# Altium schematic sheet fpga-bank1-outside.SchDoc: FPGA - Bank 1
size Letter; CheckedBy: E. Chiu; CompanyName: Brinton Engineering, LLC; DrawnBy: J. Brinton; Engineer: J. Brinton; Address1: 3479 Edison Way; Address2: Menlo Park CA 94025; Address3: +1 (877) 778-8435; Address4: brintonengineering.com; Revision: 1; SheetNumber: 9; SheetTotal: 48
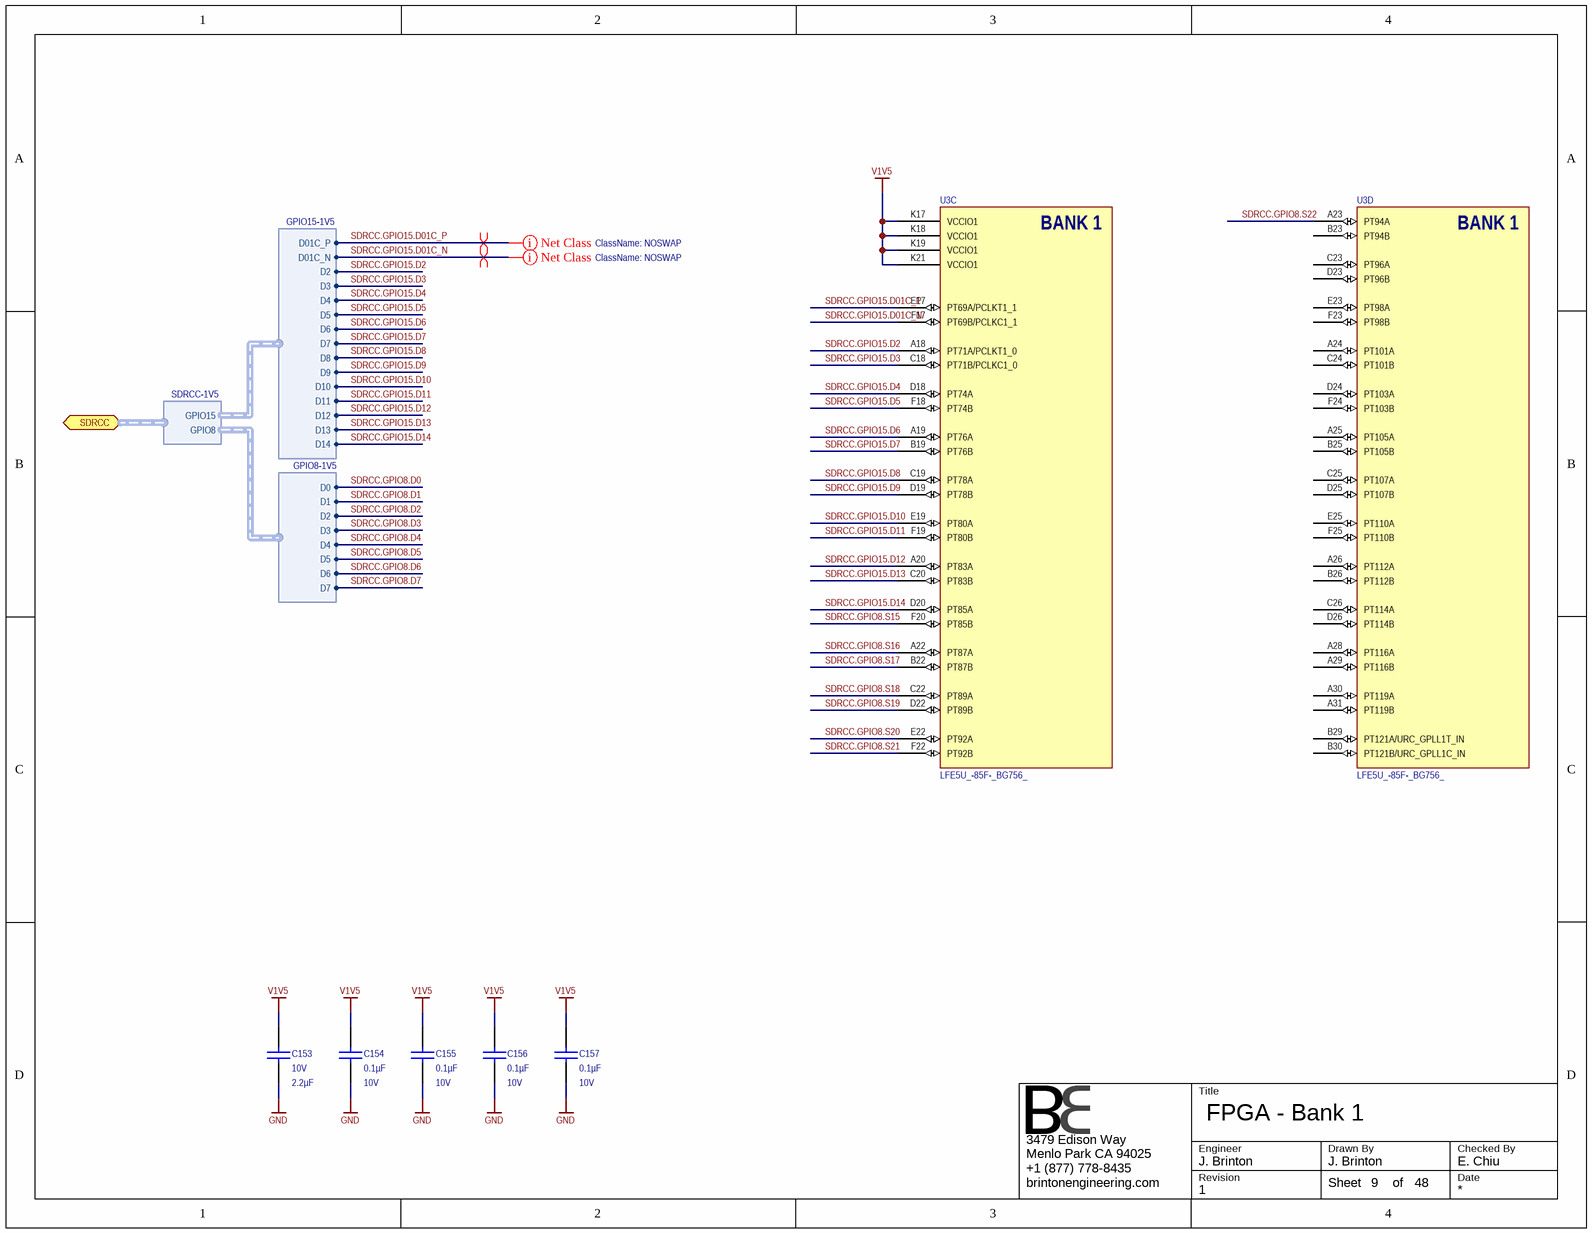
[diagram p0: fpga-bank1-outside.SchDoc]

## Parts
C153  Voltage - Rated: 10V  Capacitance: 2.2µF  [CAPC1608X90N]  (hidden comment: GRM188R71A225KE15D)
C154  Capacitance: 0.1µF  Voltage - Rated: 10V  [CAPC1005X56N]  (hidden comment: GRM155R71A104KA01J)
C155  Capacitance: 0.1µF  Voltage - Rated: 10V  [CAPC1005X56N]  (hidden comment: GRM155R71A104KA01J)
C156  Capacitance: 0.1µF  Voltage - Rated: 10V  [CAPC1005X56N]  (hidden comment: GRM155R71A104KA01J)
C157  Capacitance: 0.1µF  Voltage - Rated: 10V  [CAPC1005X56N]  (hidden comment: GRM155R71A104KA01J)
U3  LFE5U_-85F-_BG756_  [caBGA756]  (parts C,D of 19)

## Ports
SDRCC (harness SDRCC-1V5)

## Harnesses
GPIO8-1V5: D0, D1, D2, D3, D4, D5, D6, D7
GPIO15-1V5: D01C_P, D01C_N, D2, D3, D4, D5, D6, D7, D8, D9, D10, D11, D12, D13, D14
SDRCC-1V5: GPIO15, GPIO8

## Nets
GND: C153.1 C154.1 C155.1 C156.1 C157.1
V1V5: C153.2 C154.2 C155.2 C156.2 C157.2 U3.K17(VCCIO1) U3.K18(VCCIO1) U3.K19(VCCIO1) U3.K21(VCCIO1)
SDRCC.GPIO8.D0: harness GPIO8-1V5.D0
SDRCC.GPIO8.D1: harness GPIO8-1V5.D1
SDRCC.GPIO8.D2: harness GPIO8-1V5.D2
SDRCC.GPIO8.D3: harness GPIO8-1V5.D3
SDRCC.GPIO8.D4: harness GPIO8-1V5.D4
SDRCC.GPIO8.D5: harness GPIO8-1V5.D5
SDRCC.GPIO8.D6: harness GPIO8-1V5.D6
SDRCC.GPIO8.D7: harness GPIO8-1V5.D7
SDRCC.GPIO8.S15: U3.F20(PT85B)
SDRCC.GPIO8.S16: U3.A22(PT87A)
SDRCC.GPIO8.S17: U3.B22(PT87B)
SDRCC.GPIO8.S18: U3.C22(PT89A)
SDRCC.GPIO8.S19: U3.D22(PT89B)
SDRCC.GPIO8.S20: U3.E22(PT92A)
SDRCC.GPIO8.S21: U3.F22(PT92B)
SDRCC.GPIO8.S22: U3.A23(PT94A)
SDRCC.GPIO15.D01C_N: U3.F17(PT69B/PCLKC1_1) ; harness GPIO15-1V5.D01C_N
SDRCC.GPIO15.D01C_P: U3.E17(PT69A/PCLKT1_1) ; harness GPIO15-1V5.D01C_P
SDRCC.GPIO15.D2: U3.A18(PT71A/PCLKT1_0) ; harness GPIO15-1V5.D2
SDRCC.GPIO15.D3: U3.C18(PT71B/PCLKC1_0) ; harness GPIO15-1V5.D3
SDRCC.GPIO15.D4: U3.D18(PT74A) ; harness GPIO15-1V5.D4
SDRCC.GPIO15.D5: U3.F18(PT74B) ; harness GPIO15-1V5.D5
SDRCC.GPIO15.D6: U3.A19(PT76A) ; harness GPIO15-1V5.D6
SDRCC.GPIO15.D7: U3.B19(PT76B) ; harness GPIO15-1V5.D7
SDRCC.GPIO15.D8: U3.C19(PT78A) ; harness GPIO15-1V5.D8
SDRCC.GPIO15.D9: U3.D19(PT78B) ; harness GPIO15-1V5.D9
SDRCC.GPIO15.D10: U3.E19(PT80A) ; harness GPIO15-1V5.D10
SDRCC.GPIO15.D11: U3.F19(PT80B) ; harness GPIO15-1V5.D11
SDRCC.GPIO15.D12: U3.A20(PT83A) ; harness GPIO15-1V5.D12
SDRCC.GPIO15.D13: U3.C20(PT83B) ; harness GPIO15-1V5.D13
SDRCC.GPIO15.D14: U3.D20(PT85A) ; harness GPIO15-1V5.D14

Not connected (* = marked no-connect by the designer): U3 A24(PT101A) A25(PT105A) A26(PT112A) A28(PT116A) A29(PT116B) A30(PT119A) A31(PT119B) B23(PT94B) B25(PT105B) B26(PT112B) B29(PT121A/URC_GPLL1T_IN) B30(PT121B/URC_GPLL1C_IN) C23(PT96A) C24(PT101B) C25(PT107A) C26(PT114A) D23(PT96B) D24(PT103A) D25(PT107B) D26(PT114B) E23(PT98A) E25(PT110A) F23(PT98B) F24(PT103B) F25(PT110B)

## Layout directives
net class NOSWAP: SDRCC.GPIO15.D01C_N, SDRCC.GPIO15.D01C_P
differential pair: SDRCC.GPIO15.D01C_N, SDRCC.GPIO15.D01C_P

## Notes on the sheet
- Title
- Engineer
- Revision
- Drawn By
- Checked By
- Date
- Sheet
- of
- (in symbol LFE5U_-85F-_BG756_, part C) BANK 1
- (in symbol LFE5U_-85F-_BG756_, part D) BANK 1

## Library data of the parts
C153 = GRM188R71A225KE15D: CAP CER 2.2UF 10V 10% X7R 0603; Manufacturer: Murata Electronics North America; Manufacturer P/N: GRM188R71A225KE15D; Operating Temperature: -55°C ~ 125°C; Thickness (Max): 0.035" (0.90mm); Tolerance: ±10%; Package / Case: 0603 (1608 Metric); Temperature Coefficient: X7R; Supplier 1: Newark; Supplier 2: Digi-Key; RoHS: RoHS Compliant; Size / Dimension: 0.063" L x 0.031" W (1.60mm x 0.80mm); Mounting Type: Surface Mount, MLCC; ComponentLink1URL: http://www.murata.com/~/media/webrenewal/support/library/catalog/products/capacitor/mlcc/c02e.ashx; ComponentLink1Description: http://www.murata.com/~/media/webrenewal/support/library/catalog/products/capacitor/mlcc/c02e.ashx; Supplier Part Number 1: 72R4209; Supplier Part Number 2: 490-4520-1-ND
C154-C157 = GRM155R71A104KA01J: CAP CER 0.1UF 10V 10% X7R 0402; Manufacturer: Murata Electronics North America; Manufacturer P/N: GRM155R71A104KA01J; Operating Temperature: -55°C ~ 125°C; Thickness (Max): 0.022" (0.55mm); Size / Dimension: 0.039" L x 0.020" W (1.00mm x 0.50mm); RoHS: RoHS Compliant; Mounting Type: Surface Mount, MLCC; Supplier 1: Digi-Key; ComponentLink1URL: http://www.murata.com/~/media/webrenewal/support/library/catalog/products/capacitor/mlcc/c02e.ashx; ComponentLink1Description: http://www.murata.com/~/media/webrenewal/support/library/catalog/products/capacitor/mlcc/c02e.ashx; Supplier Part Number 1: 490-6322-1-ND; Temperature Coefficient: X7R; Package / Case: 0402 (1005 Metric); Tolerance: ±10%
U3 = LFE5U_-85F-_BG756_: ECP5 FPGA, 85k LUT, 756-caBGA; Manufacturer: Lattice Semiconductor; Manufacturer P/N: LFE5U_-85F-_BG756_